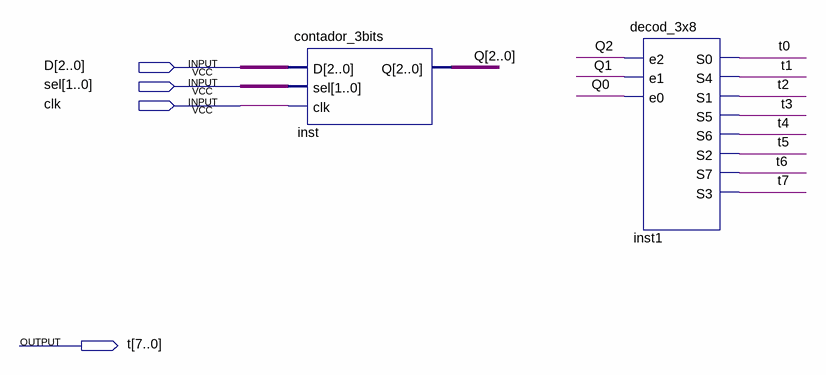
[diagram p0: schematic sheet]
// Quartus schematic temporizador.bdf as structural Verilog: 2 symbols, 4 pins
module temporizador (
  input  [2:0] D,
  input  [1:0] sel,
  input  clk,
  output [7:0] t
);

  wire [2:0] Q;

  contador_3bits inst (.D(D), .sel(sel), .clk(clk), .Q(Q));
  decod_3x8 inst1 (
    .e2(Q[2]), .e1(Q[1]), .e0(Q[0]), .S0(t[0]), .S4(t[1]), .S1(t[2]), .S5(t[3]), .S6(t[4]), .S2(t[5]),
    .S7(t[6]), .S3(t[7]));
endmodule
